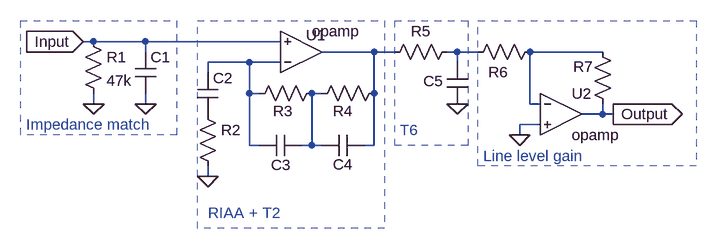
[diagram p0: schematic complete_riaa_topology.asc]
complete_riaa_topology.asc, the LTspice schematic file:
Version 4
SHEET 1 892 680
WIRE -48 80 -64 80
WIRE 32 80 -48 80
WIRE 240 80 32 80
WIRE 32 96 32 80
WIRE 384 96 304 96
WIRE 416 96 384 96
WIRE 512 96 496 96
WIRE 544 96 512 96
WIRE 736 96 624 96
WIRE 192 112 128 112
WIRE 240 112 192 112
WIRE 512 112 512 96
WIRE 128 128 128 112
WIRE 192 160 192 112
WIRE 208 160 192 160
WIRE 304 160 288 160
WIRE 384 160 384 96
WIRE -48 176 -48 160
WIRE 32 176 32 160
WIRE 624 176 624 96
WIRE 640 176 624 176
WIRE 736 192 736 176
WIRE 736 192 704 192
WIRE 752 192 736 192
WIRE 640 208 608 208
WIRE 608 224 608 208
WIRE 192 240 192 160
WIRE 208 240 192 240
WIRE 288 240 288 160
WIRE 288 240 272 240
WIRE 304 240 288 240
WIRE 384 240 384 160
WIRE 384 240 368 240
WIRE 128 288 128 272
FLAG -48 176 0
FLAG 32 176 0
FLAG 128 288 0
FLAG 512 176 0
FLAG -64 80 Input
IOPIN -64 80 In
FLAG 608 224 0
FLAG 752 192 Output
IOPIN 752 192 Out
SYMBOL OpAmps\\opamp 272 160 M180
WINDOW 0 7 90 Left 2
SYMATTR InstName U1
SYMBOL res -64 64 R0
SYMATTR InstName R1
SYMATTR Value 47k
SYMBOL cap 16 96 R0
SYMATTR InstName C1
SYMATTR Value ""
SYMBOL res 112 176 R0
SYMATTR InstName R2
SYMATTR Value ""
SYMBOL cap 112 128 R0
SYMATTR InstName C2
SYMATTR Value ""
SYMBOL res 304 144 R90
WINDOW 0 59 60 VBottom 2
WINDOW 3 32 56 VTop 2
SYMATTR InstName R3
SYMATTR Value ""
SYMBOL res 400 144 R90
WINDOW 0 59 64 VBottom 2
WINDOW 3 32 56 VTop 2
SYMATTR InstName R4
SYMATTR Value ""
SYMBOL cap 272 224 R90
WINDOW 0 62 31 VBottom 2
WINDOW 3 32 32 VTop 2
SYMATTR InstName C3
SYMATTR Value ""
SYMBOL cap 368 224 R90
WINDOW 0 61 32 VBottom 2
WINDOW 3 32 32 VTop 2
SYMATTR InstName C4
SYMATTR Value ""
SYMBOL res 512 80 R90
WINDOW 0 0 56 VBottom 2
WINDOW 3 32 56 VTop 2
SYMATTR InstName R5
SYMATTR Value ""
SYMBOL cap 496 112 R0
WINDOW 0 -36 29 Left 2
SYMATTR InstName C5
SYMATTR Value ""
SYMBOL OpAmps\\opamp 672 128 R0
SYMATTR InstName U2
SYMBOL res 640 80 R90
WINDOW 0 63 65 VBottom 2
WINDOW 3 32 56 VTop 2
SYMATTR InstName R6
SYMATTR Value ""
SYMBOL res 720 80 R0
WINDOW 0 -29 39 Left 2
SYMATTR InstName R7
SYMATTR Value ""
TEXT 424 216 Left 2 ;T6
TEXT 128 344 Left 2 ;RIAA + T2
TEXT 552 256 Left 2 ;Line level gain
TEXT -152 208 Left 2 ;Impedance match
RECTANGLE Normal 80 224 -160 48 1
RECTANGLE Normal 400 368 112 48 1
RECTANGLE Normal 528 240 416 48 1
RECTANGLE Normal 880 272 544 48 1

The netlist it stands for:
* complete_riaa_topology.asc
XU1 N004 Input N001 opamp Aol=100K GBW=10Meg  ; pins invin noninvin out
R1 Input 0 47k
C1 Input 0
R2 P001 0
C2 N004 P001
R3 N005 N004
R4 N001 N005
C3 N005 N004
C4 N001 N005
R5 N002 N001
C5 N002 0
XU2 N003 0 Output opamp Aol=100K GBW=10Meg  ; pins invin noninvin out
R6 N003 N002
R7 N003 Output
* T6
* RIAA + T2
* Line level gain
* Impedance match
.backanno
.end